# EAGLE design pi-crust13 (EAGLE 6.5.0)
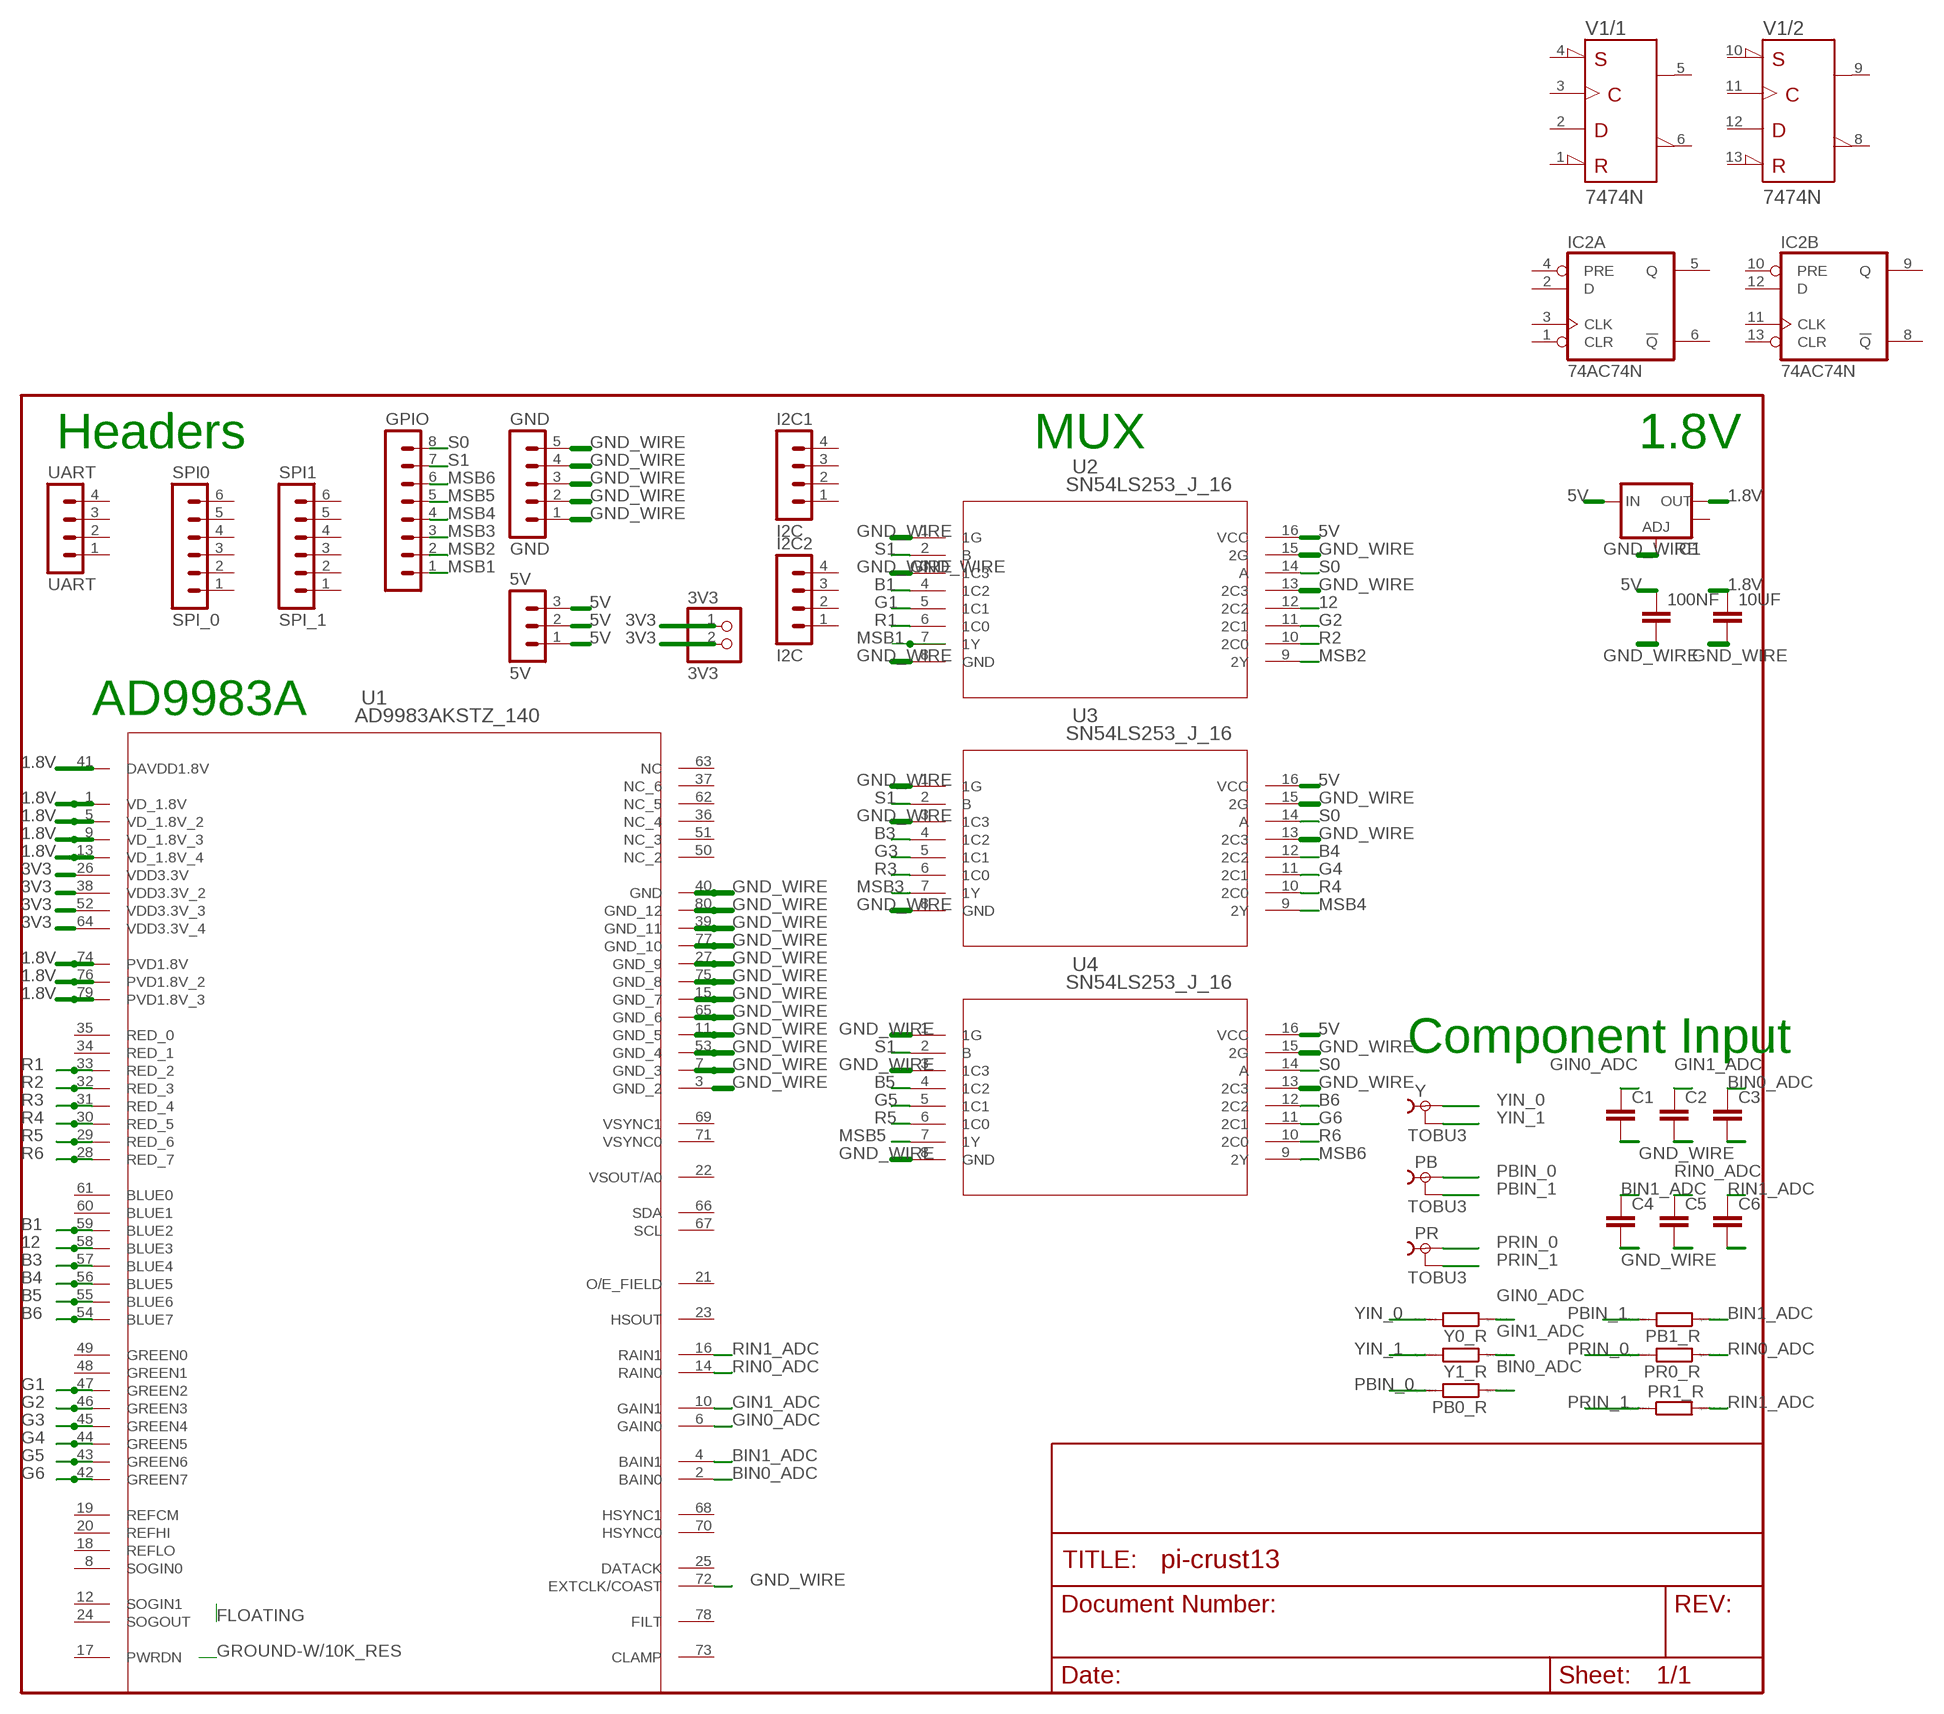
[diagram p0: schematic, sheet 1]

## Parts
3V3  3V3  PINHD-1X2  [1X02]
5V  5V  MA03-1  [MA03-1]
10UF  C2.5/5  [C2.5-5]
100NF  C2.5/5  [C2.5-5]
C1  C2.5/5  [C2.5-5]
C2  C2.5/5  [C2.5-5]
C3  C2.5/5  [C2.5-5]
C4  C2.5/5  [C2.5-5]
C5  C2.5/5  [C2.5-5]
C6  C2.5/5  [C2.5-5]
GND  GND  MA05-1  [MA05-1]
GPIO  MA08-1  [MA08-1]
I2C1  I2C  MA04-1  [MA04-1]
I2C2  I2C  MA04-1  [MA04-1]
IC1  V_REG_LM1117SOT223  [SOT223]
IC2  74AC74N  [DIL14]
PB  TOBU3  [TOBU3]
PB0_R  R0204/7  [0204/7]
PB1_R  R0204/7  [0204/7]
PR  TOBU3  [TOBU3]
PR0_R  R0204/7  [0204/7]
PR1_R  R0204/7  [0204/7]
SPI0  SPI_0  MA06-1  [MA06-1]
SPI1  SPI_1  MA06-1  [MA06-1]
U1  AD9983AKSTZ_140  [ST_80_2]
U2  SN54LS253_J_16  [J16]
U3  SN54LS253_J_16  [J16]
U4  SN54LS253_J_16  [J16]
UART  UART  MA04-1  [MA04-1]
V1  7474N  [DIL14]
Y  TOBU3  [TOBU3]
Y0_R  R0204/7  [0204/7]
Y1_R  R0204/7  [0204/7]

## Nets
1.8V: 10UF.1 IC1.2(OUT) U1.1(VD_1.8V) U1.5(VD_1.8V_2) U1.9(VD_1.8V_3) U1.13(VD_1.8V_4) U1.41(DAVDD1.8V) U1.74(PVD1.8V) U1.76(PVD1.8V_2) U1.79(PVD1.8V_3)
3V3: 3V3.1 3V3.2 U1.26(VDD3.3V) U1.38(VDD3.3V_2) U1.52(VDD3.3V_3) U1.64(VDD3.3V_4)
5V: 5V.1 5V.2 5V.3 100NF.1 IC1.3(IN) U2.16(VCC) U3.16(VCC) U4.16(VCC)
12: U1.58(BLUE3) U2.12(2C2)
B1: U1.59(BLUE2) U2.4(1C2)
B3: U1.57(BLUE4) U3.4(1C2)
B4: U1.56(BLUE5) U3.12(2C2)
B5: U1.55(BLUE6) U4.4(1C2)
B6: U1.54(BLUE7) U4.12(2C2)
BIN0_ADC: C3.1 PB0_R.1 U1.2(BAIN0)
BIN1_ADC: C4.1 PB1_R.1 U1.4(BAIN1)
G1: U1.47(GREEN2) U2.5(1C1)
G2: U1.46(GREEN3) U2.11(2C1)
G3: U1.45(GREEN4) U3.5(1C1)
G4: U1.44(GREEN5) U3.11(2C1)
G5: U1.43(GREEN6) U4.5(1C1)
G6: U1.42(GREEN7) U4.11(2C1)
GIN0_ADC: C1.1 U1.6(GAIN0) Y0_R.1
GIN1_ADC: C2.1 U1.10(GAIN1) Y1_R.1
GND_WIRE: 10UF.2 100NF.2 C1.2 C2.2 C3.2 C4.2 C5.2 C6.2 GND.1 GND.2 GND.3 GND.4 GND.5 IC1.1(ADJ) U1.3(GND_2) U1.7(GND_3) U1.11(GND_5) U1.15(GND_7) U1.27(GND_9) U1.39(GND_11) U1.40(GND) U1.53(GND_4) U1.65(GND_6) U1.75(GND_8) U1.77(GND_10) U1.80(GND_12) U2.1(1G) U2.3(1C3) U2.8(GND) U2.13(2C3) U2.15(2G) U3.1(1G) U3.3(1C3) U3.8(GND) U3.13(2C3) U3.15(2G) U4.1(1G) U4.3(1C3) U4.8(GND) U4.13(2C3) U4.15(2G)
MSB1: GPIO.1 U2.7(1Y)
MSB2: GPIO.2 U2.9(2Y)
MSB3: GPIO.3 U3.7(1Y)
MSB4: GPIO.4 U3.9(2Y)
MSB5: GPIO.5 U4.7(1Y)
MSB6: GPIO.6 U4.9(2Y)
PBIN_0: PB0_R.2 PB.1
PBIN_1: PB1_R.2 PB.2 PB.2@1 PB.2@2
PRIN_0: PR0_R.2 PR.1
PRIN_1: PR1_R.1 PR.2 PR.2@1 PR.2@2
R1: U1.33(RED_2) U2.6(1C0)
R2: U1.32(RED_3) U2.10(2C0)
R3: U1.31(RED_4) U3.6(1C0)
R4: U1.30(RED_5) U3.10(2C0)
R5: U1.29(RED_6) U4.6(1C0)
R6: U1.28(RED_7) U4.10(2C0)
RIN0_ADC: C5.1 PR0_R.1 U1.14(RAIN0)
RIN1_ADC: C6.1 PR1_R.2 U1.16(RAIN1)
S0: GPIO.8 U2.14(A) U3.14(A) U4.14(A)
S1: GPIO.7 U2.2(B) U3.2(B) U4.2(B)
YIN_0: Y0_R.2 Y.1
YIN_1: Y1_R.2 Y.2 Y.2@1 Y.2@2
Unconnected: I2C1.1 I2C1.2 I2C1.3 I2C1.4 I2C2.1 I2C2.2 I2C2.3 I2C2.4 IC1.4(OUT) IC2.1(A:CLR) IC2.2(A:D) IC2.3(A:CLK) IC2.4(A:PRE) IC2.5(A:Q) IC2.6(A:!Q) IC2.8(B:!Q) IC2.9(B:Q) IC2.10(B:PRE) IC2.11(B:CLK) IC2.12(B:D) IC2.13(B:CLR) SPI0.1 SPI0.2 SPI0.3 SPI0.4 SPI0.5 SPI0.6 SPI1.1 SPI1.2 SPI1.3 SPI1.4 SPI1.5 SPI1.6 U1.8(SOGIN0) U1.12(SOGIN1) U1.17(PWRDN) U1.18(REFLO) U1.19(REFCM) U1.20(REFHI) U1.21(O/E_FIELD) U1.22(VSOUT/A0) U1.23(HSOUT) U1.24(SOGOUT) U1.25(DATACK) U1.34(RED_1) U1.35(RED_0) U1.36(NC_4) U1.37(NC_6) U1.48(GREEN1) U1.49(GREEN0) U1.50(NC_2) U1.51(NC_3) U1.60(BLUE1) U1.61(BLUE0) U1.62(NC_5) U1.63(NC) U1.66(SDA) U1.67(SCL) U1.68(HSYNC1) U1.69(VSYNC1) U1.70(HSYNC0) U1.71(VSYNC0) U1.72(EXTCLK/COAST) U1.73(CLAMP) U1.78(FILT) UART.1 UART.2 UART.3 UART.4 V1.1(/1:!CLR) V1.2(/1:D) V1.3(/1:CLK) V1.4(/1:!PRE) V1.5(/1:Q) V1.6(/1:!Q) V1.8(/2:!Q) V1.9(/2:Q) V1.10(/2:!PRE) V1.11(/2:CLK) V1.12(/2:D) V1.13(/2:!CLR)

## Notes on the sheet
- Headers | MUX | 1.8V
- AD9983A
- Component Input

## Power pins joined to a net without a drawn wire
+UB: V1.14(/+UB:+UB)
-UB: V1.7(/-UB:-UB)
GND: IC2.7(P:GND)
VCC: IC2.14(P:VCC)

## Library data of the parts
3V3 = pinhead:PINHD-1X2: PIN HEADER
5V = con-lstb:MA03-1: PIN HEADER; OC_FARNELL: unknown; OC_NEWARK: unknown
10UF 100NF C1-C6 = capacitor-wima:C: CAPACITOR naming: grid - package width
GND = con-lstb:MA05-1: PIN HEADER; OC_FARNELL: unknown; OC_NEWARK: unknown
GPIO = con-lstb:MA08-1: PIN HEADER; OC_FARNELL: unknown; OC_NEWARK: unknown
I2C1 I2C2 UART = con-lstb:MA04-1: PIN HEADER; OC_FARNELL: unknown; OC_NEWARK: unknown
IC1 = SparkFun-PowerIC:V_REG_LM1117: Voltage Regulator LM1117 Standard adjustable voltage regulator but in SMD form. Spark Fun Electronics SKU : COM-00595
IC2 = 74xx-eu:74*74: Dual D type positive edge triggered FLIP FLOP, preset and clear
PB PR Y = con-hirschmann:TOBU3: Female Cinch CONNECTOR ( RCA Jack ); MF: FARNELL; MPN: TOBU 3; OC_FARNELL: 592791; OC_NEWARK: 06WX5914
PB0_R PB1_R PR0_R PR1_R Y0_R Y1_R = eagle-ltspice:R: RESISTOR, European symbol; SPICEMODEL: NONE; SPICEPREFIX: R
SPI0 SPI1 = con-lstb:MA06-1: PIN HEADER; OC_FARNELL: unknown; OC_NEWARK: unknown
U1 = ad9983a:AD9983AKSTZ_140
U2-U4 = MUX:SN54LS253_J_16; DATASHEETURL: http://www.ti.com/lit/gpn/SN54LS253; DESCRIPTION: Dual 4-Line To 1-Line Data Selectors/Multiplexers With 3-State Outputs; FAMILY_NAME: DATA SELECTOR/MULTIPLEXER; GENERIC_PART_NUMBER: SN54LS253; INDUSTRY_STD_PKG_TYPE: CDIP; MANUFACTURER: Texas Instruments; PACKAGE_DESIGNATOR: J; PIN_COUNT: 16
V1 = 74ttl-din:74*74: Dual D type positive edge triggered FLIP FLOP, preset and clear

## Board
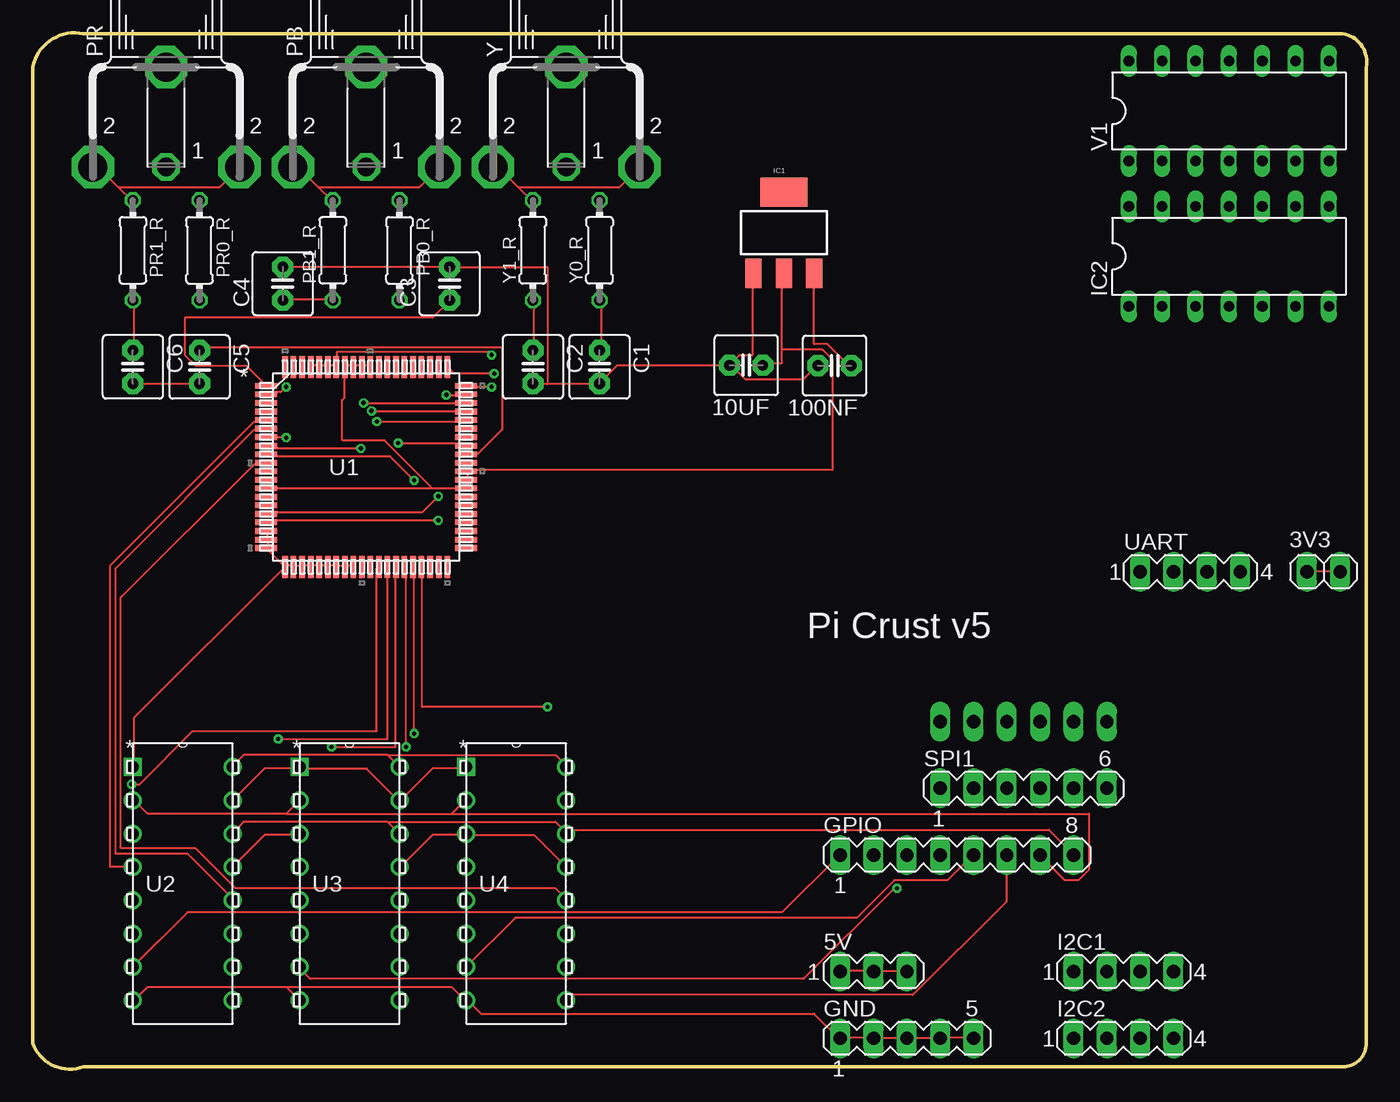
[diagram p1: board, top side]
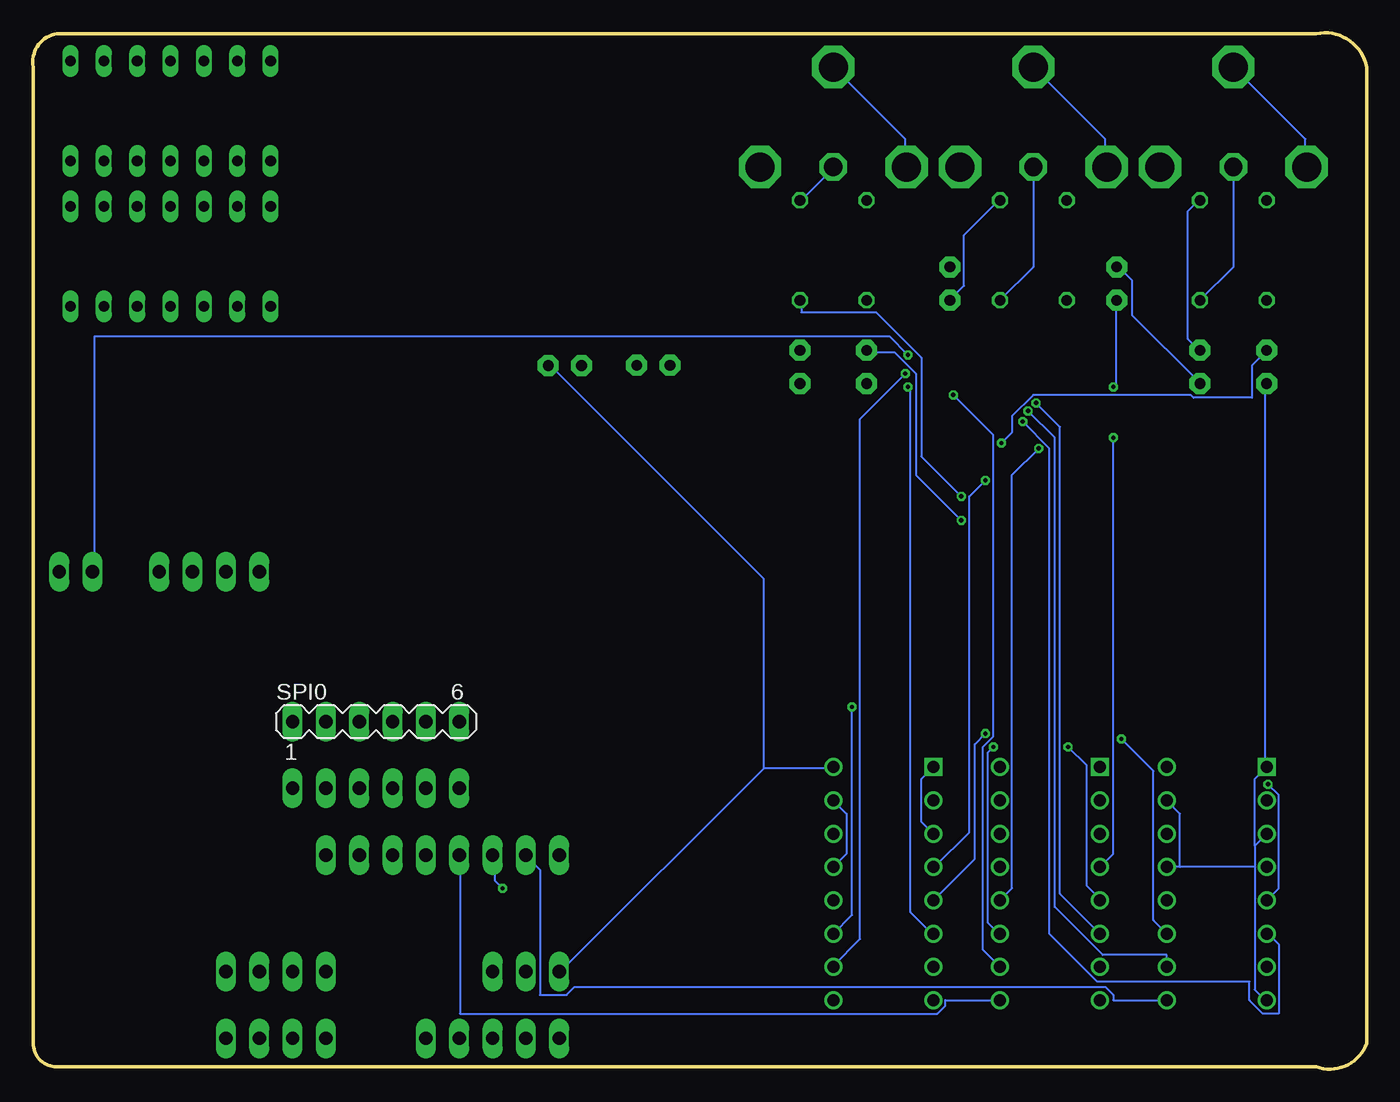
[diagram p2: board, bottom side, seen from below]

Size 101.63 x 78.97 mm. Coordinates in mm from the lower left corner, seen from the top.
Outline: 101.6,76.37 101.6,1.98 arc-90 99.82,0.18 3.82,0.18 arc-90 0,1.97 0,76.37 arc-90 3.82,78.91 99.82,78.91 arc-90 101.6,76.37
Copper layers (1*16): Top 0.0356mm / dielectric 1.5011mm / Bottom 0.0356mm
Design rules "default": minimum track width 6mil, minimum drill 13mil, track to track 6mil, track to pad 6mil, pad to pad 6mil, via to via 6mil, smd to smd 6mil, copper to edge 15mil, drill to drill 6mil, minimum pad ring 7mil, minimum via ring 7mil, stop-mask expansion 4mil, vias tented up to drill 20mil, thermal gap 10mil

### Footprints (pad centres in the part's own frame; a part is rotated, then mirrored left to right if it is on the bottom)
1X02 = drill 1.016 long: 1 -1.27,0; 2 1.27,0
MA03-1 = drill 1.016 long: 1 -2.54,0; 2 0,0; 3 2.54,0
C2.5-5 = drill 0.813 pad 1.6 octagon: 1 -1.27,0; 2 1.27,0
MA05-1 = drill 1.016 long: 1 -5.08,0; 2 -2.54,0; 3 0,0; 4 2.54,0; 5 5.08,0
MA08-1 = drill 1.016 long: 1 -8.89,0; 2 -6.35,0; 3 -3.81,0; 4 -1.27,0; 5 1.27,0; 6 3.81,0; 7 6.35,0; 8 8.89,0
MA04-1 = drill 1.016 long: 1 -3.81,0; 2 -1.27,0; 3 1.27,0; 4 3.81,0
SOT223 = smd 1.219 x 2.235: 1 -2.311,-3.099; 2 0,-3.099; 3 2.311,-3.099 | smd 3.6 x 2.2: 4 0,3.099
DIL14 = drill 0.813 long: 1 -7.62,-3.81; 2 -5.08,-3.81; 3 -2.54,-3.81; 4 0,-3.81; 5 2.54,-3.81; 6 5.08,-3.81; 7 7.62,-3.81; 8 7.62,3.81; 9 5.08,3.81; 10 2.54,3.81; 11 0,3.81; 12 -2.54,3.81; 13 -5.08,3.81; 14 -7.62,3.81
TOBU3 = drill 1.397 octagon: 1 0,-2.54 | drill 2.21 octagon: 2 5.588,-2.54; 2@1 -5.588,-2.54; 2@2 0,5.08
0204/7 = drill 0.813 octagon: 1 -3.81,0; 2 3.81,0
MA06-1 = drill 1.016 long: 1 -6.35,0; 2 -3.81,0; 3 -1.27,0; 4 1.27,0; 5 3.81,0; 6 6.35,0
ST_80_2 = smd 0.432 x 1.676: 1 0.33,7.62; 5 -0.33,7.62; 8 2.286,7.62; 9 -0.965,7.62; 12 1.626,7.62; 13 -1.626,7.62; 15 -6.172,-7.62; 18 4.216,7.62; 19 5.537,7.62; 20 4.877,7.62; 22 -4.877,7.62; 23 4.877,-7.62; 24 0.965,7.62; 26 -2.286,7.62; 27 -5.537,-7.62; 28 6.172,7.62; 38 -2.921,7.62; 39 -4.877,-7.62; 40 -4.216,-7.62; 42 4.216,-7.62; 43 3.581,-7.62; 44 2.921,-7.62; 45 2.286,-7.62; 46 1.626,-7.62; 47 0.965,-7.62; 48 0.33,-7.62; 49 -0.33,-7.62; 52 -3.581,7.62; 53 -3.581,-7.62; 64 -4.216,7.62; 65 -2.921,-7.62; 66 2.921,7.62; 67 3.581,7.62; 68 6.172,-7.62; 69 -6.172,7.62; 70 5.537,-7.62; 71 -5.537,7.62; 75 -2.286,-7.62; 77 -1.626,-7.62; 80 -0.965,-7.62 | smd 1.676 x 0.432: 2 -7.62,6.172; 3 -7.62,-4.877; 4 -7.62,5.537; 6 -7.62,-3.581; 7 -7.62,-5.537; 10 -7.62,-4.216; 11 -7.62,-6.172; 14 7.62,0.965; 16 7.62,1.626; 17 7.62,0.33; 21 7.62,-2.286; 25 -7.62,-0.965; 29 7.62,6.172; 30 7.62,5.537; 31 7.62,4.877; 32 7.62,4.216; 33 7.62,3.581; 34 7.62,2.921; 35 7.62,2.286; 36 7.62,-6.172; 37 7.62,-5.537; 41 -7.62,-1.626; 50 7.62,-4.877; 51 7.62,-4.216; 54 -7.62,0.33; 55 -7.62,0.965; 56 -7.62,1.626; 57 -7.62,2.286; 58 -7.62,2.921; 59 -7.62,3.581; 60 -7.62,4.216; 61 -7.62,4.877; 62 7.62,-3.581; 63 7.62,-2.921; 72 -7.62,-2.286; 73 -7.62,-0.33; 74 7.62,-1.626; 76 7.62,-0.965; 78 -7.62,-2.921; 79 7.62,-0.33
J16 = drill 0.914 square: 1 -7.62,17.78 | drill 0.914: 2 -7.62,15.24; 3 -7.62,12.7; 4 -7.62,10.16; 5 -7.62,7.62; 6 -7.62,5.08; 7 -7.62,2.54; 8 -7.62,0; 9 0,0; 10 0,2.54; 11 0,5.08; 12 0,7.62; 13 0,10.16; 14 0,12.7; 15 0,15.24; 16 0,17.78

### Placement (x,y rotation side)
3V3  98.35,37.91 0 top
5V  64.06,7.43 0 top
10UF  54.36,53.63 180 top
100NF  61.09,53.61 180 top
C1  43.18,53.51 270 top
C2  38.1,53.51 270 top
C3  31.75,59.86 90 top
C4  19.05,59.86 90 top
C5  12.7,53.51 270 top
C6  7.62,53.51 270 top
GND  66.6,2.35 0 top
GPIO  70.41,16.32 0 top
I2C1  83.11,7.43 0 top
I2C2  83.11,2.35 0 top
IC1  57.23,63.74 0 top
IC2  91.14,61.94 0 top
PB  25.4,71.29 0 top
PB0_R  27.94,62.4 270 top
PB1_R  22.86,62.4 90 top
PR  10.16,71.29 0 top
PR0_R  12.7,62.4 270 top
PR1_R  7.62,62.4 270 top
SPI0  75.49,26.48 0 bottom
SPI1  75.49,21.4 0 top
U1  25.4,45.89 0 top
U2  15.24,5.25 0 top
U3  27.94,5.25 0 top
U4  40.64,5.25 0 top
UART  88.19,37.91 0 top
V1  91.14,73.02 0 top
Y  40.64,71.29 0 top
Y0_R  43.18,62.4 90 top
Y1_R  38.1,62.4 90 top

### Tracks (layer width: path | path; a pad name or v marks a point on that pad's centre or on a via)
1.8V
  Top 0.152: 57.1,54.83 57.1,53.81 55.68,53.81 10UF.1 | 57.1,54.83 57.1,60.52 IC1.2 | U1.1 25.6,53.61 25.2,53.61 U1.5 24.99,53.61 24.59,53.61 U1.9 24.38,53.61 23.77,53.61 U1.13 23.77,51.17 23.57,50.97 23.57,47.92 26.82,47.92 30.48,44.26 | 30.48,44.26 U1.74 33.12,44.26 33.12,44.87 U1.76 33.12,45.07 33.12,45.48 U1.79 33.12,45.68 60.96,45.68 60.96,54.02 60.15,54.83 57.1,54.83 | 30.48,44.26 U1.41
3V3  (via drill 0.33)
  Top 0.152: U1.64 21.34,53.61 21.74,53.61 U1.52 21.95,53.61 22.35,53.61 U1.38 22.55,53.61 22.96,53.61 U1.26 23.16,53.61 23.16,54.63 34.75,54.63 v34.95,54.42 | 3V3.2 99.57,37.96 97.13,37.96 3V3.1
  Bottom 0.152: v34.95,54.42 36.37,55.84 96.93,55.84 96.93,37.96 3V3.1
5V
  Top 0.152: IC1.3 59.54,55.23 60.55,55.23 62.18,53.61 100NF.1 | 5V.1 61.57,7.48 64.01,7.48 5V.2 64.21,7.48 66.45,7.48 5V.3 | 27.03,23.94 16.05,23.94 15.24,23.13 U2.16 | U3.16 27.03,23.94 | 27.03,23.94 39.83,23.94 40.64,23.13 U4.16
  Bottom 0.152: 45.92,22.93 61.37,7.48 5V.1 | 45.92,22.93 40.64,22.93 U4.16 | 45.92,22.93 45.92,37.35 62.18,53.61 100NF.1
12
  Top 0.152: U1.58 17.68,48.73 16.87,48.73 6.3,38.17 6.3,16.42 11.79,16.42 15.24,12.97 U2.12
B1
  Top 0.152: U2.4 5.89,15.41 5.89,38.37 16.87,49.34 17.68,49.34 U1.59
B3  (via drill 0.33)
  Top 0.152: v19.3,48.12 17.88,48.12 U1.57
  Bottom 0.152: v19.3,48.12 19.3,16.42 U3.4
B4  (via drill 0.33)
  Top 0.152: v24.99,47.31 18.09,47.31 17.88,47.51 U1.56
  Bottom 0.152: v24.99,47.31 27.03,45.28 27.03,13.78 U3.12
B5  (via drill 0.33)
  Top 0.152: v29.06,44.87 27.23,46.7 17.88,46.7 U1.55
  Bottom 0.152: v29.06,44.87 30.28,43.65 30.28,18.05 32.92,15.41 U4.4
B6
  Top 0.152: U1.54 17.68,46.09 16.87,46.09 6.71,35.93 6.71,16.83 12.39,16.83 15.44,13.78 39.83,13.78 40.64,12.97 U4.12
BIN0_ADC
  Top 0.152: U1.2 17.68,52.19 16.26,53.61 12.39,53.61 11.58,54.42 11.58,57.27 30.48,57.27 31.7,58.49 C3.1
  Bottom 0.152: PB0_R.1 28.04,66.21 30.68,63.57 30.68,59.71 31.7,58.69 C3.1
BIN1_ADC  (via drill 0.33)
  Top 0.152: v19.3,51.98 18.9,51.58 17.88,51.58 U1.4 | PB1_R.1 22.76,58.69 19.1,58.69 C4.1
  Bottom 0.152: v19.3,51.98 19.1,52.19 19.1,58.49 C4.1
G1  (via drill 0.33)
  Top 0.152: v7.52,21.71 8.13,21.71 12.19,25.77 26.21,25.77 26.21,38.17 U1.47
  Bottom 0.152: v7.52,21.71 6.71,20.89 6.71,13.78 U2.5
G2  (via drill 0.33)
  Top 0.152: U1.46 27.03,25.16 v18.69,25.16
  Bottom 0.152: v18.69,25.16 16.26,22.72 16.26,11.34 U2.11
G3  (via drill 0.33)
  Top 0.152: v22.76,24.55 27.64,24.55 27.64,38.17 U1.45
  Bottom 0.152: v22.76,24.55 21.34,23.13 21.34,13.99 20.32,12.97 U3.5
G4  (via drill 0.33)
  Top 0.152: v28.45,24.55 28.45,38.17 U1.44
  Bottom 0.152: v28.45,24.55 28.85,24.15 28.85,11.14 28.04,10.33 U3.11
G5  (via drill 0.33)
  Top 0.152: v29.06,25.57 29.06,38.17 U1.43
  Bottom 0.152: v29.06,25.57 29.87,24.75 29.87,16.02 U4.5
G6  (via drill 0.33)
  Top 0.152: v39.22,27.6 29.67,27.6 29.67,38.17 U1.42
  Bottom 0.152: v39.22,27.6 39.22,11.75 U4.11
GIN0_ADC  (via drill 0.33)
  Top 0.152: v30.89,43.65 29.67,42.43 17.88,42.43 U1.6 | C1.1 43.28,54.83 43.28,58.49 Y0_R.1
  Bottom 0.152: v30.89,43.65 33.93,46.7 33.93,54.22 37.39,57.67 43.08,57.67 43.08,58.49 Y0_R.1
GIN1_ADC  (via drill 0.33)
  Top 0.152: v30.89,41.82 17.88,41.82 U1.10 | Y1_R.1 38.2,58.49 38.2,54.83 C2.1
  Bottom 0.152: v30.89,41.82 34.34,45.28 34.34,53 35.97,54.63 38,54.63 C2.1
GND_WIRE
  Top 0.152: 39.22,52.19 43.08,52.19 C1.2 43.28,52.39 44.5,53.61 53.03,53.61 10UF.2 | 39.22,52.19 38.2,52.19 C2.2 | IC1.1 54.86,60.52 54.86,54.42 53.85,54.42 53.24,53.81 10UF.2 | 100NF.2 59.74,53.61 58.73,52.59 54.25,52.59 53.24,53.61 10UF.2 | C6.2 7.72,52.19 12.6,52.19 C5.2 | C4.2 C3.2 39.22,61.13 39.22,52.19 | U4.1 32.92,22.93 30.48,22.93 28.04,20.49 U3.15 27.84,20.49 25.4,22.93 20.32,22.93 | U3.13 28.04,15.41 30.48,17.85 32.92,17.85 U4.3 33.12,17.85 38.2,17.85 U4.13 | GND.5 71.53,2.4 69.29,2.4 GND.4 69.09,2.4 66.65,2.4 GND.3 66.45,2.4 64.21,2.4 GND.2 64.01,2.4 61.57,2.4 GND.1 61.37,2.4 59.54,4.23 34.14,4.23 33.12,5.25 U4.8 32.92,5.25 31.9,6.26 19.3,6.26 | U2.15 17.68,22.93 20.32,22.93 | U2.13 17.68,17.85 20.32,17.85 U3.3 | U1.3 17.88,41.01 17.88,40.4 U1.7 17.88,40.2 17.88,39.79 U1.11 17.88,39.59 19.1,38.37 U1.15 | U1.15 19.3,38.37 19.71,38.37 U1.27 19.91,38.37 20.52,38.37 | 23.77,38.37 23.16,38.37 U1.75 22.96,38.37 22.55,38.37 U1.65 22.35,38.37 21.95,38.37 U1.53 21.74,38.37 21.34,38.37 U1.40 21.13,38.37 20.52,38.37 | 23.77,38.37 24.38,38.37 U1.80 | 23.77,38.37 U1.77 | 20.52,38.37 U1.39 | 19.3,6.26 U3.8 | 19.3,6.26 8.74,6.26 7.72,5.25 U2.8 | U1.15 19.1,38.17 7.72,26.79 7.72,23.13 U2.1 | 20.32,22.93 U3.1
  Bottom 0.152: C5.2 12.8,52.39 17.88,57.47 17.88,60.11 18.9,61.13 C4.2 | U4.13 39.62,16.42 39.62,19.47 U4.15 | U4.1 33.93,22.11 33.93,18.86 U4.3 | 8.53,17.03 8.53,15.41 | 8.53,15.41 8.53,6.06 7.72,5.25 U2.8 | U2.3 8.53,17.03 | 8.53,17.03 8.53,22.11 U2.1 7.72,23.13 7.72,52.19 C6.2 | 8.53,15.41 14.22,15.41 | 14.22,15.41 U2.13 | U2.15 14.22,19.47 14.22,15.41
MSB1
  Top 0.152: U2.7 11.79,11.95 57.1,11.95 61.37,16.22 GPIO.1
MSB2
  Bottom 0.152: U2.9 19.3,5.25 19.3,5.65 19.91,6.26 60.35,6.26 60.96,5.65 62.99,5.65 62.99,15.2 64.01,16.22 GPIO.2
MSB3  (via drill 0.33)
  Top 0.152: v65.84,13.78 65.63,13.78 58.73,6.87 21.13,6.87 20.32,7.69 U3.7
  Bottom 0.152: v65.84,13.78 66.45,14.39 66.45,16.22 GPIO.3
MSB4
  Bottom 0.152: U3.9 32.11,5.25 32.11,4.84 32.72,4.23 69.09,4.23 69.09,16.22 GPIO.4
MSB5
  Top 0.152: U4.7 36.78,11.55 62.79,11.55 65.63,14.39 69.7,14.39 71.53,16.22 GPIO.5
MSB6
  Top 0.152: U4.9 41.05,5.65 67.06,5.65 74.17,12.77 74.17,16.22 GPIO.6
PBIN_0
  Bottom 0.152: PB0_R.2 25.4,61.13 PB.1
PBIN_1
  Top 0.152: 21.74,67.22 20.32,68.65 19.91,68.65 PB.2@1 | 21.74,67.22 22.76,66.21 PB1_R.2 | PB.2 29.46,67.22 21.74,67.22
  Bottom 0.152: PB.2@2 19.91,70.88 19.91,68.85 PB.2@1
PRIN_0
  Bottom 0.152: PR0_R.2 10.16,61.13 PR.1
PRIN_1
  Top 0.152: 6.5,67.22 5.08,68.65 4.67,68.65 PR.2@1 | 6.5,67.22 7.52,66.21 PR1_R.1 | PR.2 14.22,67.22 6.5,67.22
  Bottom 0.152: PR.2@2 4.67,70.88 4.67,68.85 PR.2@1
R1  (via drill 0.33)
  Top 0.152: v26.21,49.34 32.92,49.34 U1.33
  Bottom 0.152: v26.21,49.34 24.18,47.31 24.18,10.33 20.52,6.67 8.94,6.67 8.94,5.25 7.92,4.23 6.71,4.23 6.71,9.51 7.52,10.33 U2.6
R2  (via drill 0.33)
  Top 0.152: v25.81,50.15 32.92,50.15 U1.32
  Bottom 0.152: v25.81,50.15 23.77,48.12 23.77,12.36 20.12,8.7 15.24,8.7 U2.10
R3  (via drill 0.33)
  Top 0.152: v25.2,50.76 U1.31
  Bottom 0.152: v25.2,50.76 23.37,48.94 23.37,13.38 U3.6
R4  (via drill 0.33)
  Top 0.152: v31.5,51.37 32.92,51.37 U1.30
  Bottom 0.152: v31.5,51.37 28.45,48.33 28.45,25.36 29.26,24.55 29.26,9.11 U3.10
R5  (via drill 0.33)
  Top 0.152: v34.95,51.98 33.12,51.98 U1.29
  Bottom 0.152: v34.95,51.98 34.75,51.78 34.75,11.95 33.12,10.33 U4.6
R6  (via drill 0.33)
  Top 0.152: v35.15,53 32.11,53 31.7,53.41 U1.28
  Bottom 0.152: v35.15,53 38.61,49.55 38.61,9.92 40.64,7.89 U4.10
RIN0_ADC
  Top 0.152: U1.14 33.12,46.9 33.93,46.9 35.76,48.73 35.76,55.03 13.01,55.03 12.8,54.83 C5.1
  Bottom 0.152: PR0_R.1 12.8,66.21 13.61,65.39 13.61,55.64 12.8,54.83 C5.1
RIN1_ADC  (via drill 0.33)
  Top 0.152: v27.84,47.72 32.72,47.72 32.92,47.51 U1.16 | PR1_R.2 7.72,58.49 7.72,54.83 C6.1
  Bottom 0.152: v27.84,47.72 27.03,48.53 27.03,49.75 25.4,51.37 13.41,51.37 13.21,51.17 8.74,51.17 8.74,53.61 7.72,54.63 C6.1
S0
  Top 0.152: 27.03,18.86 16.05,18.86 15.24,18.05 U2.14 | U3.14 27.03,18.86 | 40.44,18.25 39.83,18.86 27.03,18.86 | 40.44,18.25 40.64,18.05 U4.14 40.44,18.25 | 40.44,18.25 77.42,18.25 79.25,16.42 GPIO.8
S1
  Top 0.152: 19.3,19.47 8.74,19.47 7.72,20.49 U2.2 | U3.2 19.3,19.47 | 31.9,19.47 32.92,20.49 U4.2 | 19.3,19.47 31.9,19.47 | 31.9,19.47 80.47,19.47 80.47,15.2 79.65,14.39 78.64,14.39 76.81,16.22 GPIO.7
YIN_0
  Bottom 0.152: Y0_R.2 43.08,66.21 40.64,68.65 Y.1
YIN_1
  Top 0.152: 36.98,67.22 35.56,68.65 35.15,68.65 Y.2@1 | 36.98,67.22 38,66.21 Y1_R.2 | Y.2 44.7,67.22 36.98,67.22
  Bottom 0.152: Y.2@2 35.15,70.88 35.15,68.85 Y.2@1

### Text on the board
tNames: Pi Crust v5